# EAGLE design TSAL-TS (EAGLE 9.4.0)
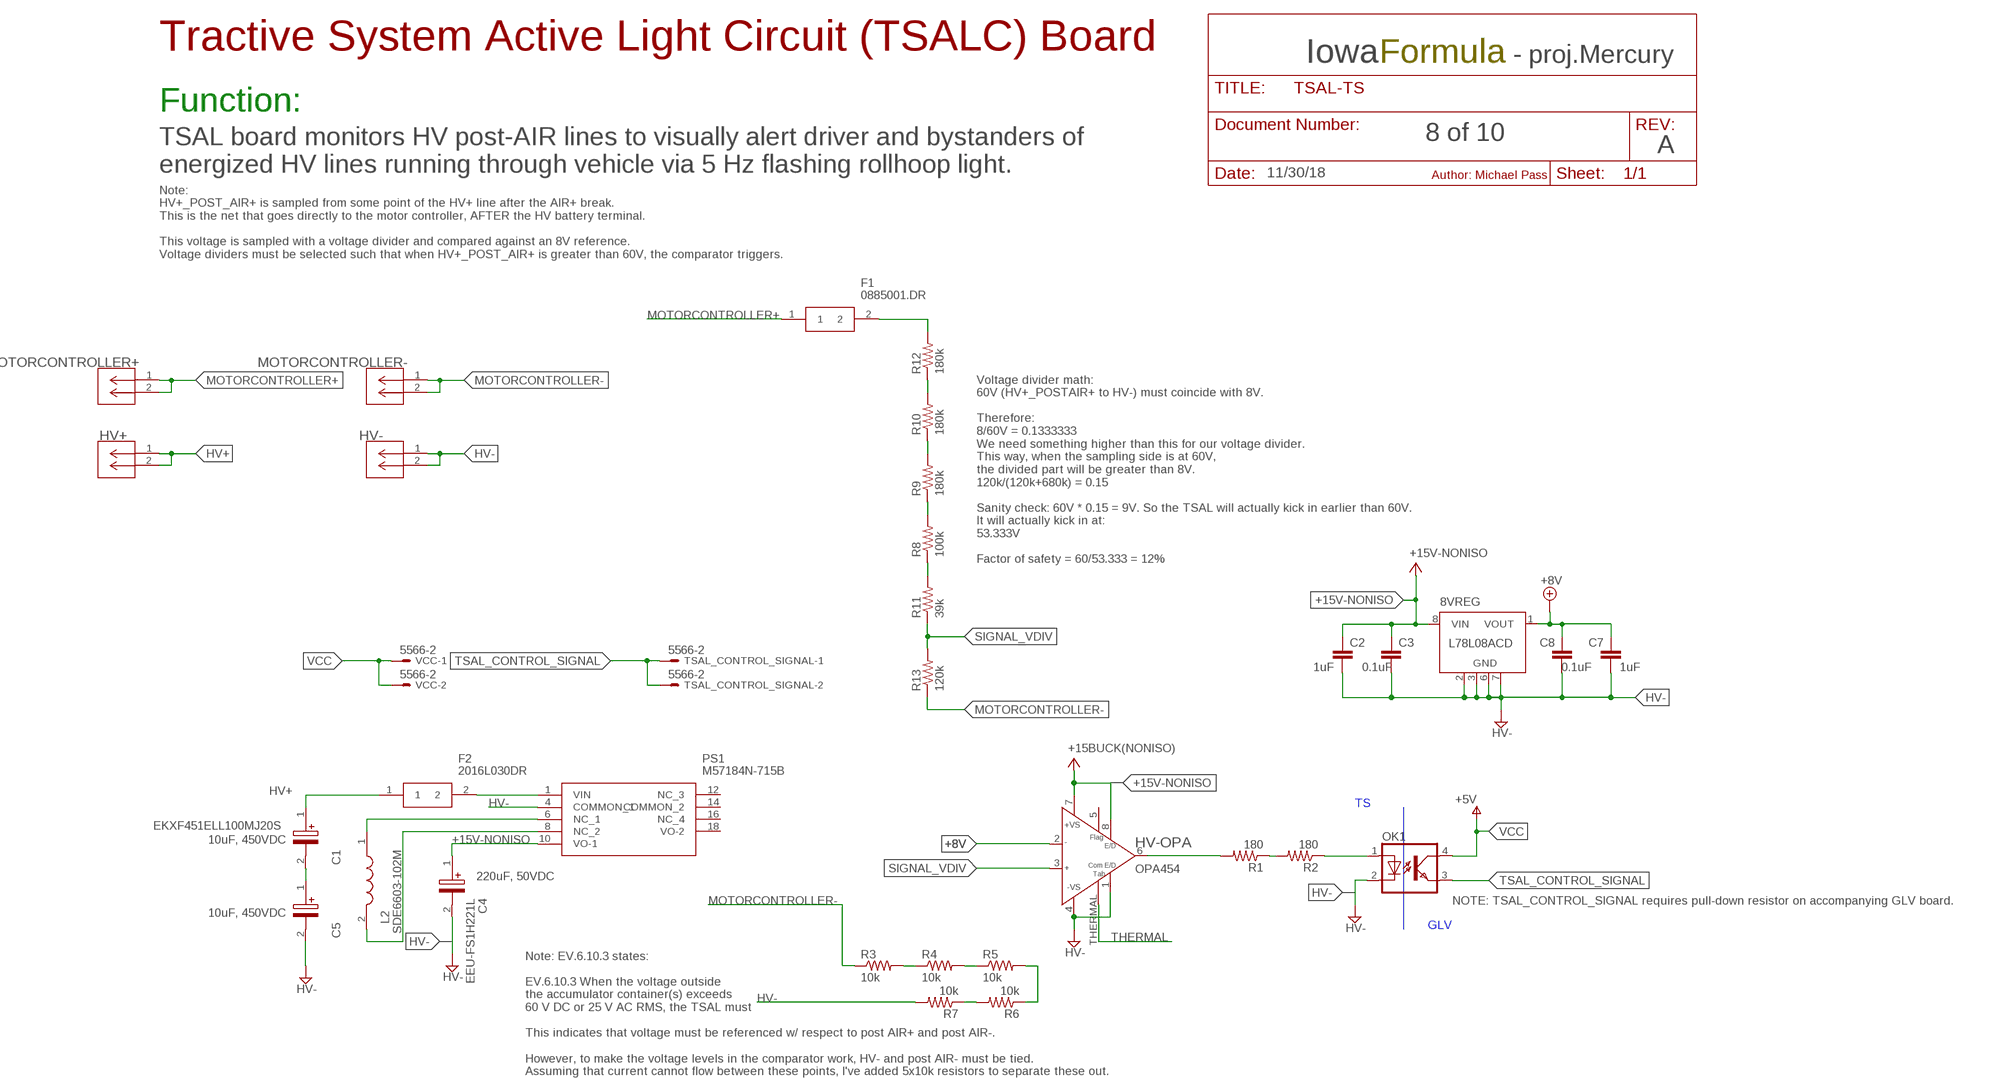
[diagram p0: schematic, sheet 1]

## Parts
8VREG  L78L08ACD  78L08SMD  [SO08]
C1  EKXF451ELL100MJ20S  [CAPPRD500W60D1025H2150]
C2  1uF  C-EUC0805  [C0805]
C3  0.1uF  C-EUC0805  [C0805]
C4  EEU-FS1H221L  [CAPPRD350W65D800H2200]
C5  EKXF451ELL100MJ20S  [CAPPRD500W60D1025H2150]
C7  1uF  C-EUC0805  [C0805]
C8  0.1uF  C-EUC0805  [C0805]
F1  0885001.DR  [FUSC10948X488N]
F2  2016L030DR  [FUSC5141X125N]
HV+  2P_1-770166-0  [CON2_1X2_P163_VMNL-1MTG]
HV-  2P_1-770166-0  [CON2_1X2_P163_VMNL-1MTG]
HV-OPA  OPA454  [SO08GP]
L2  SDE6603-102M  [SDE6603]
MOTORCONTROLLER+  2P_1-770166-0  [CON2_1X2_P163_VMNL-1MTG]
MOTORCONTROLLER-  2P_1-770166-0  [CON2_1X2_P163_VMNL-1MTG]
OK1  PC817-S  [SOP04(2.54)]
PS1  M57184N-715B  [M57184N715B]
R1  180  R-US_R0805  [R0805]
R2  180  R-US_R0805  [R0805]
R3  10k  R-US_R0805  [R0805]
R4  10k  R-US_R0805  [R0805]
R5  10k  R-US_R0805  [R0805]
R6  10k  R-US_R0805  [R0805]
R7  10k  R-US_R0805  [R0805]
R8  100k  R-US_R0805  [R0805]
R9  180k  R-US_R0805  [R0805]
R10  180k  R-US_R0805  [R0805]
R11  39k  R-US_R0805  [R0805]
R12  180k  R-US_R0805  [R0805]
R13  120k  R-US_R0805  [R0805]
TSAL_CONTROL_SIGNAL  5566-2  [5566-2]
VCC  5566-2  [5566-2]

## Nets
+8V: 8VREG.1(VOUT) C7.1 C8.1 HV-OPA.2(IN-)
+15V-NONISO: 8VREG.8(VIN) C2.1 C3.1 C4.1(+) HV-OPA.7(+VS) HV-OPA.8(E/D) PS1.10(VO-1) ; supply symbol labelled +15BUCK(NONISO)
HV+: C1.1(+) F2.1 HV+.1 HV+.2
HV-: 8VREG.2(GND) 8VREG.3(GND) 8VREG.6(GND) 8VREG.7(GND) C2.2 C3.2 C4.2(-) C5.2(-) C7.2 C8.2 HV-.1 HV-.2 HV-OPA.1(E/DCOM) HV-OPA.4(-VS) OK1.2(C) PS1.4(COMMON_1) R7.2
MOTORCONTROLLER+: F1.1 MOTORCONTROLLER+.1 MOTORCONTROLLER+.2
MOTORCONTROLLER+_POST_FUSE: F1.2 R12.2
MOTORCONTROLLER-: MOTORCONTROLLER-.1 MOTORCONTROLLER-.2 R3.1 R13.1
N$1: L2.2 PS1.8(NC_2)
N$2: L2.1 PS1.6(NC_1)
N$3: C1.2(-) C5.1(+)
N$4: F2.2 PS1.1(VIN)
N$5: R3.2 R4.1
N$6: R4.2 R5.1
N$7: R5.2 R6.1
N$8: R6.2 R7.1
N$9: HV-OPA.6(OUT) R1.2
N$10: OK1.1(A) R2.1
N$11: R10.2 R12.1
N$12: R9.2 R10.1
N$13: R8.2 R9.1
N$14: R8.1 R11.2
N$15: R1.1 R2.2
SIGNAL_VDIV: HV-OPA.3(IN+) R11.1 R13.2
THERMAL: HV-OPA.THERMAL(E/DCOM1)
TSAL_CONTROL_SIGNAL: OK1.3(EMIT) TSAL_CONTROL_SIGNAL.1 TSAL_CONTROL_SIGNAL.2
VCC: OK1.4(COL) VCC.1 VCC.2 ; supply symbol labelled +5V
Unconnected: 8VREG.4(NC) 8VREG.5(NC) HV-OPA.5(STATUS) PS1.12(NC_3) PS1.14(COMMON_2) PS1.16(NC_4) PS1.18(VO-2)

## Notes on the sheet
- Tractive System Active Light Circuit (TSALC) Board
- Iowa | Formula | - proj.Mercury
- Function:
- 8 of 10
- A
- TSAL board monitors HV post-AIR lines to visually alert driver and bystanders of 
  energized HV lines running through vehicle via 5 Hz flashing rollhoop light.
- 11/30/18 | Author: Michael Pass
- Note:
  HV+_POST_AIR+ is sampled from some point of the HV+ line after the AIR+ break. 
  This is the net that goes directly to the motor controller, AFTER the HV battery terminal.
  
  This voltage is sampled with a voltage divider and compared against an 8V reference. 
  Voltage dividers must be selected such that when HV+_POST_AIR+ is greater than 60V, the comparator triggers.
- Voltage divider math:
  60V (HV+_POSTAIR+ to HV-) must coincide with 8V.
  
  Therefore:
  8/60V = 0.1333333
  We need something higher than this for our voltage divider.
  This way, when the sampling side is at 60V,
  the divided part will be greater than 8V.
  120k/(120k+680k) = 0.15
  
  Sanity check: 60V * 0.15 = 9V. So the TSAL will actually kick in earlier than 60V.
  It will actually kick in at:
  53.333V
  
  Factor of safety = 60/53.333 = 12%
- TS
- 10uF, 450VDC
- 220uF, 50VDC
- NOTE: TSAL_CONTROL_SIGNAL requires pull-down resistor on accompanying GLV board.
- 10uF, 450VDC
- GLV
- Note: EV.6.10.3 states:
  
  EV.6.10.3 When the voltage outside
  the accumulator container(s) exceeds
  60 V DC or 25 V AC RMS, the TSAL must
  
  This indicates that voltage must be referenced w/ respect to post AIR+ and post AIR-.
  
  However, to make the voltage levels in the comparator work, HV- and post AIR- must be tied.
  Assuming that current cannot flow between these points, I've added 5x10k resistors to separate these out.

## Library data of the parts
8VREG = linear:78L*SMD: Positive VOLTAGE REGULATOR
C1 C5 = EKXF451ELL100MJ20S:EKXF451ELL100MJ20S: Aluminum Electrolytic Capacitors - Radial Leaded 10uF 20% 450V Long Life Source: Datasheet <https://www.mouser.com/datasheet/2/420/United-Chemi-Con-1511290.pdf>; DESCRIPTION: Aluminum Electrolytic Capacitors - Radial Leaded 10uF 20% 450V Long Life; HEIGHT: 21.5mm; MANUFACTURER_NAME: United Chemi-Con (UCC); MANUFACTURER_PART_NUMBER: EKXF451ELL100MJ20S; MOUSER_PART_NUMBER: 661-EKXF451ELL100MJ2
C2 C3 C7 C8 = rcl:C-EU: CAPACITOR, European symbol; SPICEPREFIX: C
C4 = EEU-FS1H221L:EEU-FS1H221L: Aluminum Electrolytic Capacitors - Radial Leaded 50VDC 220uF 9000H 8x20mm Source: Datasheet <https://componentsearchengine.com/Datasheets/1/EEU-FS1H221L.pdf>; DESCRIPTION: Aluminum Electrolytic Capacitors - Radial Leaded 50VDC 220uF 9000H 8x20mm; HEIGHT: 22mm; MANUFACTURER_NAME: Panasonic; MANUFACTURER_PART_NUMBER: EEU-FS1H221L; MOUSER_PART_NUMBER: 667-EEU-FS1H221L; MOUSER_PRICE-STOCK: https://www.mouser.com/Search/Refine.aspx?Keyword=667-EEU-FS1H221L
F1 = 0885001.DR:0885001.DR: LITTELFUSE - 0885001.DR - FUSE, AEC-Q200, 1A, 500VDC, 0402 Source: Datasheet <https://m.littelfuse.com/~/media/electronics/datasheets/fuses/littelfuse_fuse_885_datasheet.pdf.pdf>; DESCRIPTION: LITTELFUSE - 0885001.DR - FUSE, AEC-Q200, 1A, 500VDC, 0402; HEIGHT: 4.88mm; MANUFACTURER_NAME: LITTELFUSE; MANUFACTURER_PART_NUMBER: 0885001.DR; MOUSER_PART_NUMBER: 576-0885001.DR; MOUSER_PRICE-STOCK: https://www.mouser.com/Search/Refine.aspx?Keyword=576-0885001.DR
F2 = SamacSys_Parts:2016L030DR: Littelfuse 0.3A Surface Mount Resettable Fuse, 60 V dc Source: Datasheet <https://componentsearchengine.com/Datasheets/1/2016L030DR.pdf>; DESCRIPTION: Littelfuse 0.3A Surface Mount Resettable Fuse, 60 V dc; HEIGHT: 1.25mm; MANUFACTURER_NAME: LITTELFUSE; MANUFACTURER_PART_NUMBER: 2016L030DR; MOUSER_PART_NUMBER: 576-2016L030DR; MOUSER_PRICE-STOCK: https://www.mouser.com/Search/Refine.aspx?Keyword=576-2016L030DR
HV+ HV- MOTORCONTROLLER+ MOTORCONTROLLER- = con-MATE-N-LOK:2P_1-770166-0; MANUFACTURER_PART_NUMBER: 17701660; VENDOR: TE Connectivity
HV-OPA = OPA454:OPA454: TexasInstruments High-Voltage (100V), High-Current (50mA) Operatioanl Amplifier, G = 1 Stable http://focus.ti.com/lit/ds/symlink/opa454.pdf; AVAILABILITY: Unavailable; DESCRIPTION: High Voltage _100V_ High-Current _50mA_ Operational Amplifiers G=1 Stable; MF: Texas Instruments; MP: OPA454; PACKAGE: None; PRICE: None
L2 = SDE6603-102M:SDE6603-102M: SMD Power Inductor 1000uH 20% 250mA 6603 Bourns SDE6603 Series Shielded Wire-wound SMD Inductor with a Ferrite Core, 1000 uH Wire-Wound 70mA Idc Source: Datasheet <https://componentsearchengine.com/Datasheets/1/SDE6603-102M.pdf>; DESCRIPTION: SMD Power Inductor 1000uH 20% 250mA 6603 Bourns SDE6603 Series Shielded Wire-wound SMD Inductor with a Ferrite Core, 1000 uH Wire-Wound 70mA Idc; HEIGHT: mm; MANUFACTURER_NAME: Bourns; MANUFACTURER_PART_NUMBER: SDE6603-102M; MOUSER_PART_NUMBER: 652-SDE6603-102M; MOUSER_PRICE-STOCK: https://www.mouser.com/Search/Refine.aspx?Keyword=652-SDE6603-102M
OK1 = iowaFormula:PC817-S: SHARP OPTO COUPLER
PS1 = M57184N-715B:M57184N-715B: High Voltage Input DC-to-DC Converter Source: Datasheet <https://4donline.ihs.com/images/VipMasterIC/IC/PWRX/PWRXS01028/PWRXS01028-1.pdf?hkey=EF798316E3902B6ED9A73243A3159BB0>; DESCRIPTION: High Voltage Input DC-to-DC Converter; HEIGHT: 24.5mm; MANUFACTURER_NAME: POWEREX; MANUFACTURER_PART_NUMBER: M57184N-715B
R1-R13 = rcl:R-US_: RESISTOR, American symbol; SPICEPREFIX: R
TSAL_CONTROL_SIGNAL VCC = con-molex:5566-2: Mini FIT connector 2 pol Source: http://www.molex.com; MF: MOLEX; OC_FARNELL: 1822072; OC_NEWARK: unknown

## Board
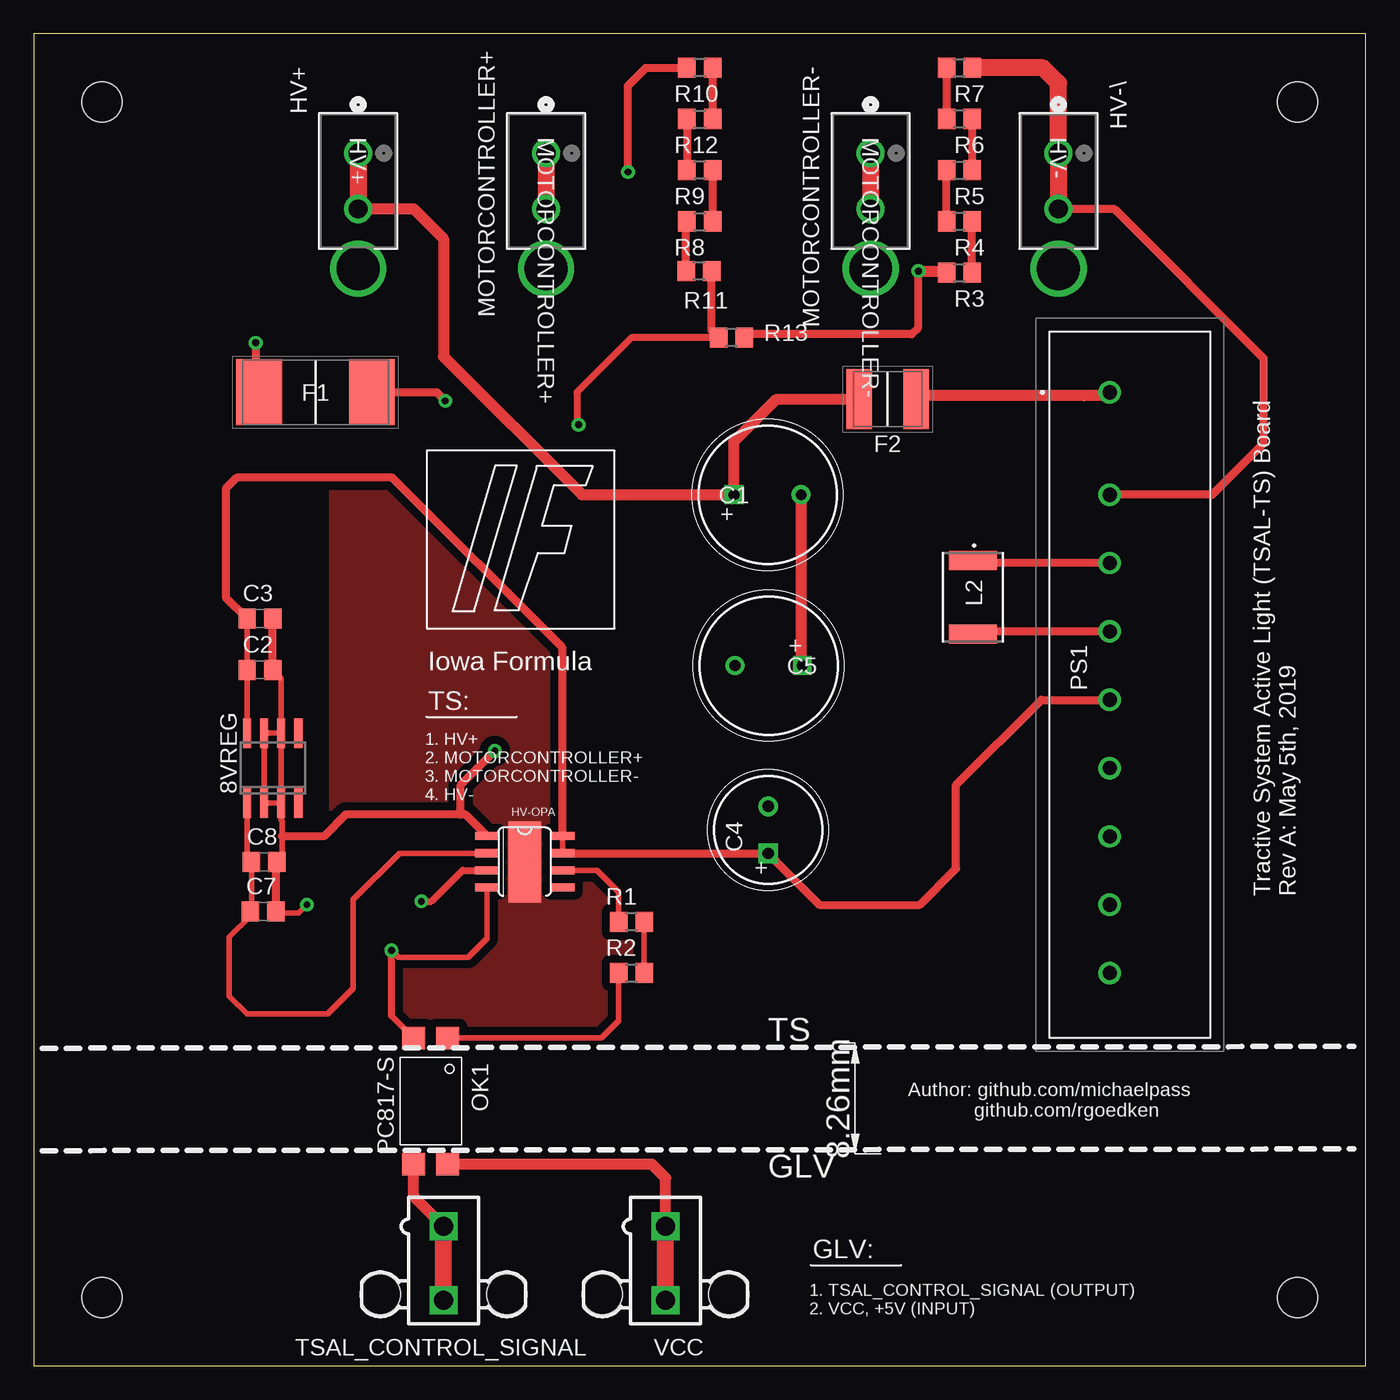
[diagram p1: board, top side]
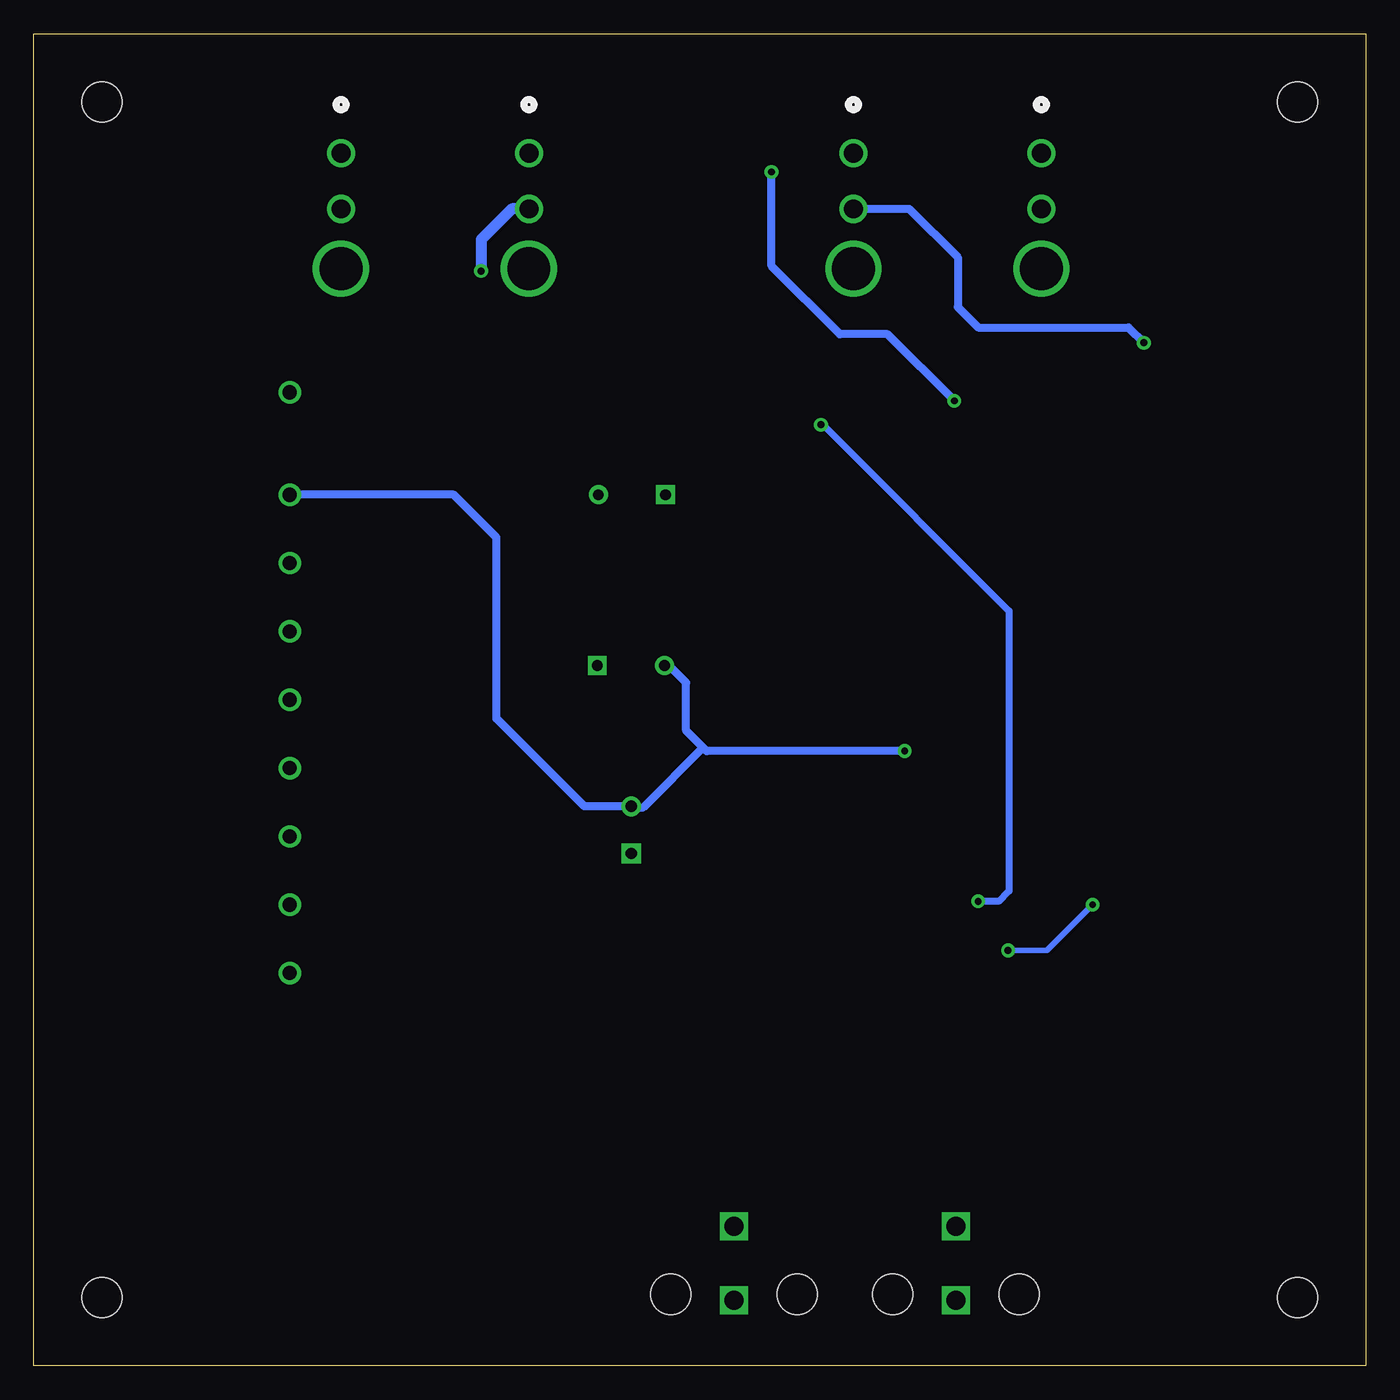
[diagram p2: board, bottom side, seen from below]

Size 99.06 x 99.06 mm. Coordinates in mm from the lower left corner, seen from the top.
Outline: 0,0 99.06,0 99.06,99.06 0,99.06 0,0
Copper layers (1*16): Top 0.035mm / dielectric 1.5mm / Bottom 0.035mm
Design rules "default *": minimum track width 8mil, minimum drill 20mil, track to track 8mil, track to pad 8mil, pad to pad 8mil, via to via 8mil, smd to smd 8mil, copper to edge 10mil, drill to drill 8mil, minimum pad ring 12mil, minimum via ring 10mil, stop-mask expansion 4mil, vias tented up to drill 25mil, thermal gap 10mil
Holes 3 mm at 5.08,5.08 93.98,5.08 93.98,93.98 5.08,93.98

### Footprints (pad centres in the part's own frame; a part is rotated, then mirrored left to right if it is on the bottom)
SO08 = smd 0.6 x 2.2: 1 -1.905,-2.6; 2 -0.635,-2.6; 3 0.635,-2.6; 4 1.905,-2.6; 5 1.905,2.6; 6 0.635,2.6; 7 -0.635,2.6; 8 -1.905,2.6
CAPPRD500W60D1025H2150 = drill 0.8 pad 1.2 square: 1 0,0 | drill 0.8 pad 1.2: 2 5,0
C0805 = smd 1.3 x 1.5: 1 -0.95,0; 2 0.95,0
CAPPRD350W65D800H2200 = drill 0.85 pad 1.275 square: 1 0,0 | drill 0.85 pad 1.275: 2 3.5,0
FUSC10948X488N = smd 3.41 x 4.91: 1 -4.195,0; 2 4.195,0
FUSC5141X125N = smd 1.9 x 4.44: 1 -2.125,0; 2 2.125,0
CON2_1X2_P163_VMNL-1MTG = drill 1.397 pad 1.905: 1 0,0; 2 4.14,0 | drill 3.175 pad 3.175: 3 8.585,0
SO08GP = smd 0.6 x 1.8: 1 -1.925,-2.8; 2 -0.655,-2.8; 3 0.615,-2.8; 4 1.885,-2.8; 5 1.885,2.8; 6 0.615,2.8; 7 -0.655,2.8; 8 -1.925,2.8 | smd 6 x 2.4: THERMAL 0,0
SDE6603 = smd 1.4 x 3.56: 1 -2.73,0; 2 2.73,0
SOP04(2.54) = smd 1.68 x 1.71: 1 -4.692,1.27; 2 -4.692,-1.27; 3 4.692,-1.27; 4 4.692,1.27
M57184N715B = drill 1.05 pad 1.575: 1 0,0; 4 7.62,0; 6 12.7,0; 8 17.78,0; 10 22.86,0; 12 27.94,0; 14 33.02,0; 16 38.1,0; 18 43.18,0
R0805 = smd 1.3 x 1.5: 1 -0.95,0; 2 0.95,0
5566-2 = drill 1.4 square: 1 0,-2.75; 2 0,2.75 | hole 3: 4.7,2.29; -4.7,2.29

### Placement (x,y rotation side)
8VREG  17.78,44.45 0 top
C1  52.07,64.77 0 top
C2  16.83,51.75 0 top
C3  16.83,55.56 0 top
C4  54.61,38.1 90 top
C5  57.15,52.07 180 top
C7  17.08,33.78 0 top
C8  17.14,37.47 0 top
F1  20.95,72.39 0 top
F2  63.5,71.88 0 top
HV+  24.13,90.17 270 top
HV-  76.2,90.17 270 top
HV-OPA  36.51,37.47 270 top
L2  69.85,57.15 270 top
MOTORCONTROLLER+  38.1,90.17 270 top
MOTORCONTROLLER-  62.23,90.17 270 top
OK1  29.53,19.68 270 top
PS1  80.01,72.39 270 top
R1  44.45,33.02 180 top
R2  44.45,29.21 0 top
R3  68.83,81.28 0 top
R4  68.83,85.09 180 top
R5  68.83,88.9 0 top
R6  68.83,92.71 180 top
R7  68.83,96.52 0 top
R8  49.53,85.09 0 top
R9  49.53,88.9 180 top
R10  49.53,92.71 0 top
R11  49.47,81.41 180 top
R12  49.53,96.52 180 top
R13  51.88,76.45 180 top
TSAL_CONTROL_SIGNAL  30.48,7.62 180 top
VCC  46.99,7.62 180 top

### Tracks (layer width: path | path; a pad name or v marks a point on that pad's centre or on a via)
+8V
  Top 0.406: 8VREG.1 15.88,37.78 C8.1 16.2,33.85 C7.1 16.13,33.47 14.55,31.89 14.55,27.49 15.88,26.16 21.84,26.16 23.75,28.07 23.75,34.67 27.2,38.12 HV-OPA.2
+15V-NONISO
  Top 0.406: C3.1 C2.1 8VREG.8 | 54.59,38.12 C4.1 | HV-OPA.8 HV-OPA.7
  Top 0.61: C3.1 14.3,57.14 14.3,65.22 15.11,66.04 26.67,66.04 39.31,53.4 HV-OPA.8 | C4.1 58.42,34.29 65.9,34.29 68.58,36.97 68.58,43.18 74.93,49.53 PS1.10 | HV-OPA.7 54.59,38.12
HV+
  Top 0.813: HV+.2 28.27,86.03 30.48,83.82 30.48,75.06 40.77,64.77 C1.1 52.07,68.71 55.24,71.88 F2.1
  Top 1.27: HV+.1 HV+.2
HV-  (via drill 0.51)
  Top 0.406: 8VREG.6 8VREG.7 8VREG.2 8VREG.3 | 18.13,33.68 19.71,33.68 v20.32,34.29 | C8.2 18.48,37.85 18.48,39.37 18.48,40.51 18.41,40.58 8VREG.3 | HV-OPA.4 33.71,31.77 32.32,30.37 27.12,30.37 v26.61,30.89 26.61,30.48 | OK1.2 26.61,26.03 | 8VREG.6 18.41,51.12 C2.2 | 8VREG.6 8VREG.3
  Top 0.508: 26.61,26.03 26.61,30.48
  Top 0.61: HV-.2 80.34,86.03 91.44,74.93 91.44,68.58 87.63,64.77 PS1.4 | C8.2 18.03,37.4 C7.2 18.13,33.68 | C2.2 C3.2 | HV-OPA.1 32.11,41 31.75,41 | 31.75,41 23.22,41 21.59,39.37 18.48,39.37 | 31.75,41 31.75,43.18 v34.29,45.72
  Top 1.27: HV-.2 HV-.1 76.2,95.38 75.06,96.52 R7.2
  Bottom 0.203: 58.11,41.6 58.17,41.66
  Bottom 0.406: v26.61,30.89 23.72,30.89 v20.32,34.29
  Bottom 0.61: 58.17,41.66 64.64,48.13 64.64,61.59 67.82,64.77 PS1.4 | v34.29,45.72 49.02,45.72 49.28,45.97 | 49.28,45.97 50.55,47.24 50.55,50.8 51.82,52.07 C5.2 | 49.28,45.97 53.72,41.53 54.54,41.53 C4.2 58.11,41.6
MOTORCONTROLLER+  (via drill 0.51)
  Top 0.61: v16.51,76.07 16.51,72.64 F1.1
  Top 1.27: MOTORCONTROLLER+.1 MOTORCONTROLLER+.2
  Bottom 0.61: MOTORCONTROLLER+.2 33.96,86.03 30.35,82.42 30.35,78.74 28.83,77.22 17.65,77.22 v16.51,76.07
MOTORCONTROLLER+_POST_FUSE  (via drill 0.51)
  Top 0.61: F1.2 29.97,72.39 v30.61,71.75 | R12.2 45.53,96.52 44.2,95.18 v44.2,88.77
  Bottom 0.61: v30.61,71.75 35.56,76.71 39.12,76.71 44.2,81.79 v44.2,88.77
MOTORCONTROLLER-  (via drill 0.51)
  Top 0.61: R3.1 67.75,81.15 | R13.1 53.08,76.71 65.28,76.71 65.79,77.22 v65.79,81.41
  Top 0.813: v65.79,81.41 67.5,81.41 67.75,81.15
  Top 1.27: MOTORCONTROLLER-.1 MOTORCONTROLLER-.2
  Bottom 0.813: MOTORCONTROLLER-.2 63.5,86.03 65.79,83.74 v65.79,81.41
N$1
  Top 0.61: L2.2 70.04,54.61 PS1.8
N$2
  Top 0.61: L2.1 70.04,59.69 PS1.6
N$3
  Top 0.813: C1.2 57.07,52.15 C5.1
N$4
  Top 0.813: F2.2 65.88,72.14 78.11,72.14 79.76,72.14 PS1.1
N$5
  Top 0.61: R3.2 R4.1
N$6
  Top 0.61: R4.2 R5.1
N$7
  Top 0.61: R6.1 R5.2
N$8
  Top 0.61: R7.1 R6.2
N$9
  Top 0.406: HV-OPA.6 39.33,36.83 41.91,36.83 43.5,35.24 R1.2
N$10
  Top 0.406: R2.1 43.5,25.65 42.22,24.38 OK1.1
N$11
  Top 0.61: R12.1 R10.2
N$12
  Top 0.61: R10.1 R9.2
N$13
  Top 0.61: R9.1 R8.2
N$14
  Top 0.61: R11.2 48.52,85.03 R8.1
N$15
  Top 0.406: R1.1 R2.2
SIGNAL_VDIV  (via drill 0.51)
  Top 0.508: R13.2 44.45,76.45 40.39,72.39 40.39,69.86 v40.51,69.98 | HV-OPA.3 31.9,36.85 29.59,34.54 v28.83,34.54
  Top 0.61: R13.2 50.42,76.97 R11.1
  Bottom 0.508: v40.51,69.98 40.39,69.98 26.54,56.13 26.54,35.31 27.3,34.54 v28.83,34.54
THERMAL
  pour Top (isolate 0.61, no thermals): 22.1,69.89 22.1,29.97 26.67,25.4 46.05,25.4 48.38,28.21 48.24,69.56
TSAL_CONTROL_SIGNAL
  Top 0.813: TSAL_CONTROL_SIGNAL.1 28.26,12.59 OK1.3
  Top 1.27: TSAL_CONTROL_SIGNAL.2 TSAL_CONTROL_SIGNAL.1
VCC
  Top 0.813: OK1.4 45.97,14.99 46.99,13.97 VCC.1
  Top 1.27: VCC.2 VCC.1

### Text on the board
tNames: HV+ | HV-\ | MOTORCONTROLLER+ | MOTORCONTROLLER- | + | + | Iowa Formula | TS: | 1. HV+ / 2. MOTORCONTROLLER+ / 3. MOTORCONTROLLER- / 4. HV- | + | Tractive System Active Light (TSAL-TS) Board / Rev A: May 5th, 2019 | TS | Author: github.com/michaelpass / github.com/rgoedken | GLV | GLV: | 1. TSAL_CONTROL_SIGNAL (OUTPUT) / 2. VCC, +5V (INPUT)